# Altium schematic sheet rectifier.SchDoc
size A; SheetNumber: 1; SheetTotal: 4
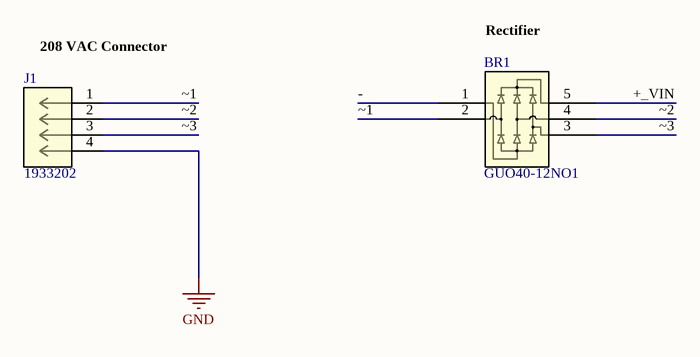
[diagram p0: rectifier.SchDoc]

## Parts
BR1  GUO40-12NO1  [SIP5-GUFP_LTF]
J1  1933202  [CONN_1933202_PXC]

## Nets
GND: J1.4
+_VIN: BR1.5
-: BR1.1
~1: BR1.2 J1.1
~2: BR1.4 J1.2
~3: BR1.3 J1.3

## Notes on the sheet
- (near J1) 208 VAC Connector
- Rectifier

## Library data of the parts
BR1 = GUO40-12NO1: No Description Available; Mfr_Name: Littelfuse Inc; RefDes: RefDes; Type: Type
J1 = 1933202: No Description Available; Mfr_Name: Phoenix Contact; RefDes: RefDes; Type: Type